# EAGLE design IoT_Pro_04 (EAGLE 7.3.0)
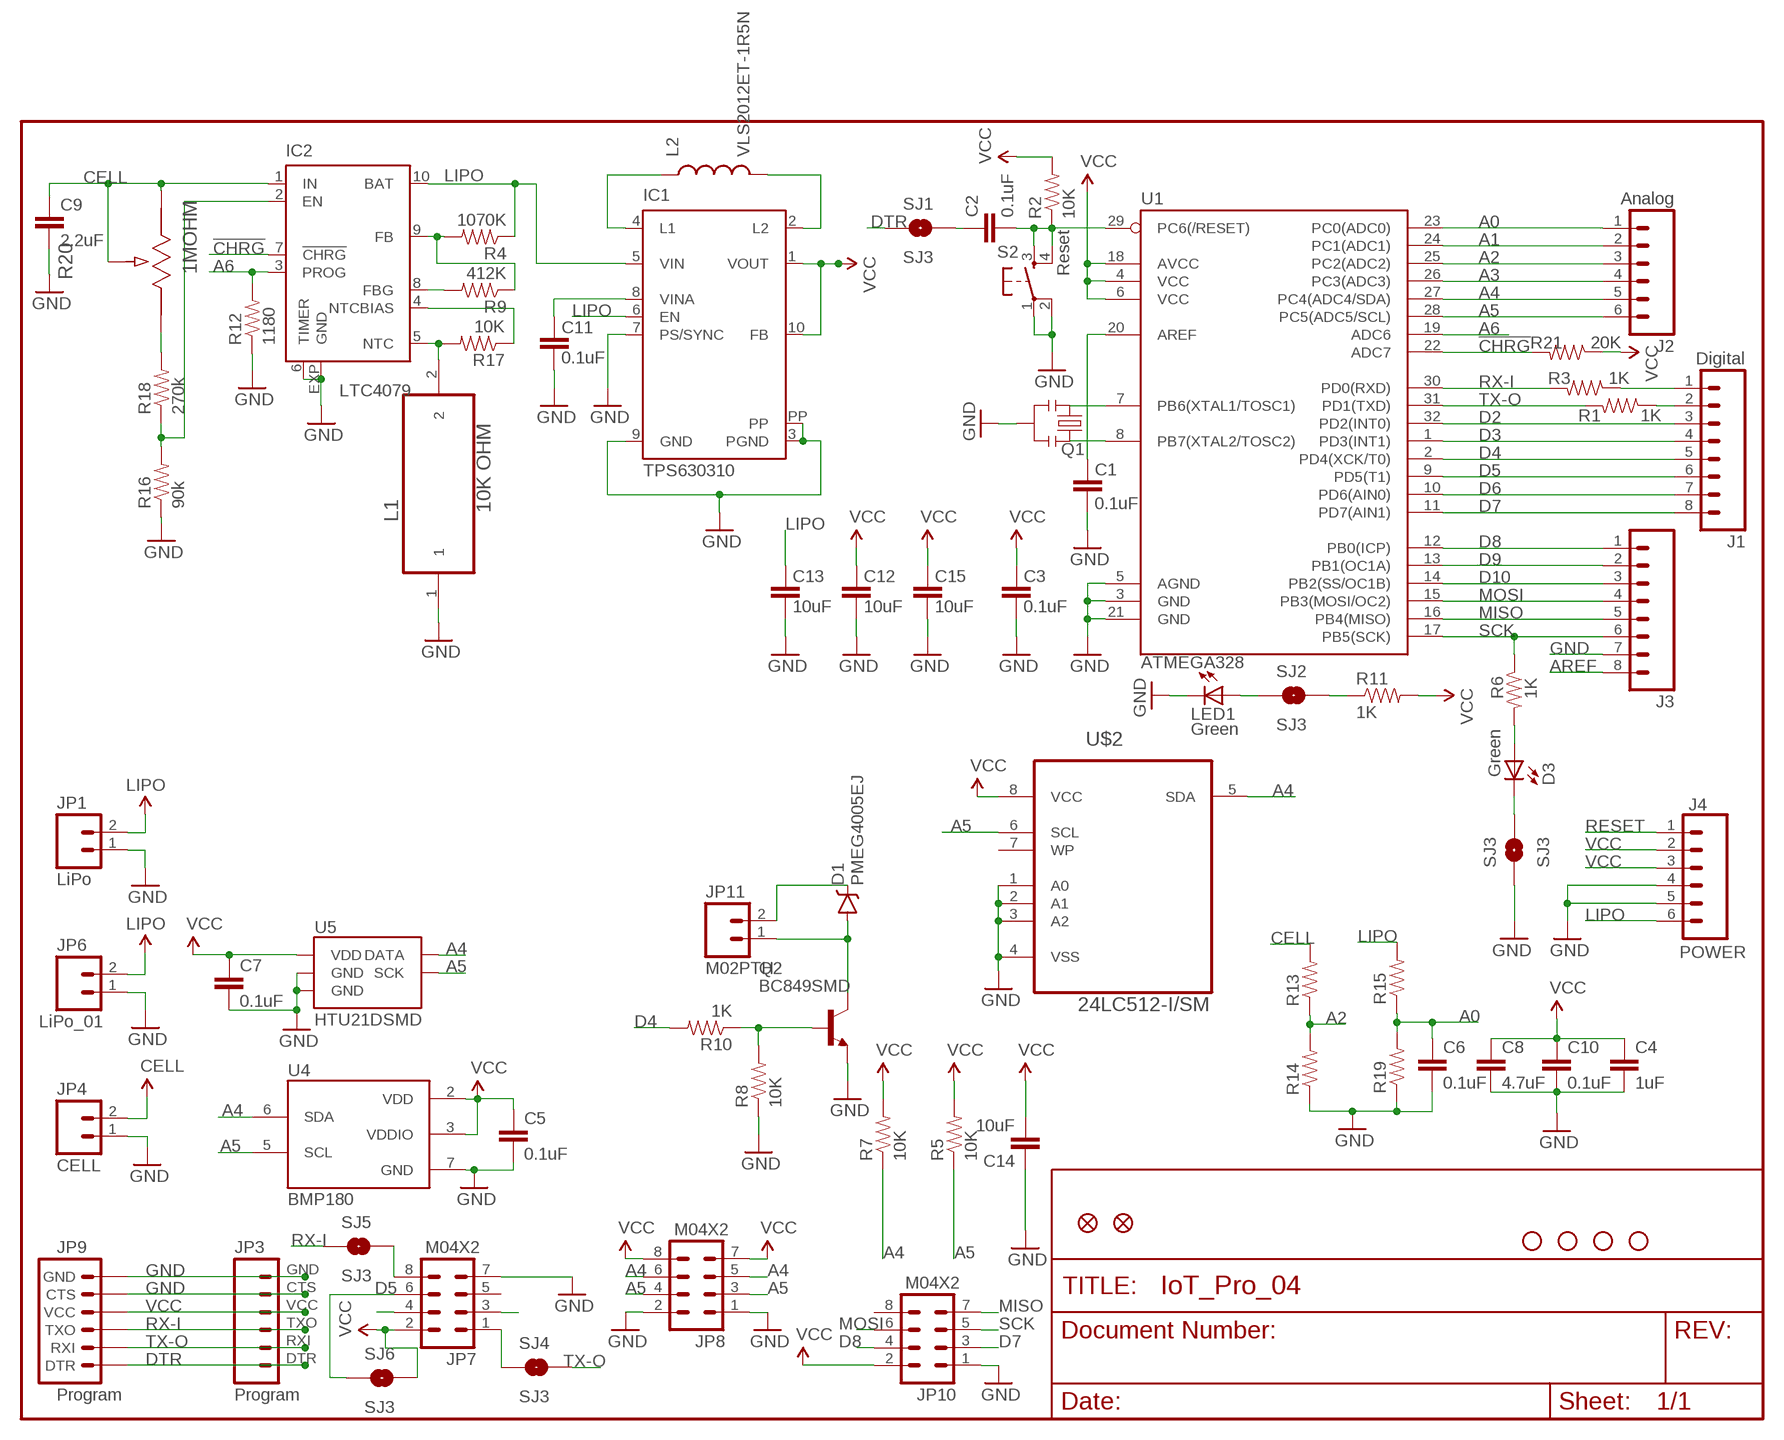
[diagram p0: schematic, sheet 1]

## Parts
C1  0.1uF  CAP0805  [0805]
C2  0.1uF  CAP0805  [0805]
C3  0.1uF  CAP0805  [0805]
C4  1uF  CAP0805  [0805]
C5  0.1uF  CAP0805  [0805]
C6  0.1uF  CAP0805  [0805]
C7  0.1uF  CAP0805  [0805]
C8  4.7uF  CAP0805  [0805]
C9  2.2uF  CAP0805  [0805]
C10  0.1uF  CAP0805  [0805]
C11  0.1uF  CAP0805  [0805]
C12  10uF  CAP0805  [0805]
C13  10uF  CAP0805  [0805]
C14  10uF  CAP0805  [0805]
C15  10uF  CAP0805  [0805]
D1  PMEG4005EJ  DIODE-SCHOTTKY-PMEG4005EJ  [SOD-323]
D3  Green  LG_T679-E1F1-1  [PLCC2]
IC1  TPS630310  [S-PDSO-N10]
IC2  LTC4079  [DFN10-3X3]
J1  Digital  M081X08  [1X08]
J2  Analog  M06SIP  [1X06]
J3  M081X08  [1X08]
J4  POWER  M06SIP  [1X06]
JP1  LiPo  M02POLAR  [MOLEX-1X2]
JP2  FIDUCIAL1X2.5  [FIDUCIAL-1X2.5]
JP3  Program  M06SIP  [1X06]
JP4  CELL  M02POLAR  [MOLEX-1X2]
JP5  FIDUCIAL1X2.5  [FIDUCIAL-1X2.5]
JP6  LiPo_01  M02PTH  [1X02]
JP7  M04X2  [2X4]
JP8  M04X2  [2X4]
JP9  Program  ARDUINO_SERIAL_PROGRAMSMD  [1X06-SMD]
JP10  M04X2  [2X4]
JP11  M02PTH  [1X02]
L1  10K OHM  B57421V2103J62  [THERM_B57421V2103J62]
L2  VLS2012ET-1R5N  INDUCTOR1007  [1007]
LED1  Green  LG_T679-E1F1-1  [PLCC2]
Q1  8MHZ  RESONATOR8MHZ  [RESONATOR-SMD]
Q2  BC849SMD  [SOT23-BEC]
R1  1K  RESISTOR0805-RES  [0805]
R2  10K  RESISTOR0805-RES  [0805]
R3  1K  RESISTOR0805-RES  [0805]
R4  1070K  RESISTOR0805-RES  [0805]
R5  10K  RESISTOR0805-RES  [0805]
R6  1K  RESISTOR0805-RES  [0805]
R7  10K  RESISTOR0805-RES  [0805]
R8  10K  RESISTOR0805-RES  [0805]
R9  412K  RESISTOR0805-RES  [0805]
R10  1K  RESISTOR0805-RES  [0805]
R11  1K  RESISTOR0805-RES  [0805]
R12  1180  RESISTOR0805-RES  [0805]
R13  RESISTOR0805-RES  [0805]
R14  RESISTOR0805-RES  [0805]
R15  RESISTOR0805-RES  [0805]
R16  90k  RESISTOR0805-RES  [0805]
R17  10K  RESISTOR0805-RES  [0805]
R18  270k  RESISTOR0805-RES  [0805]
R19  RESISTOR0805-RES  [0805]
R20  1MOHM  EVM2NSX80B16-2N  [POT_EVM2N]
R21  20K  RESISTOR0805-RES  [0805]
S2  Reset  TAC_SWITCHSMD  [TACTILE_SWITCH_SMD]
SJ1  SJ3  SOLDERJUMPERNC2  [SJ_2S-NOTRACE]
SJ2  SJ3  SOLDERJUMPERNC2  [SJ_2S-NOTRACE]
SJ3  SJ3  SOLDERJUMPERNC2  [SJ_2S-NOTRACE]
SJ4  SJ3  SOLDERJUMPERNC2  [SJ_2S-NOTRACE]
SJ5  SJ3  SOLDERJUMPERNC2  [SJ_2S-NOTRACE]
SJ6  SJ3  SOLDERJUMPERNC2  [SJ_2S-NOTRACE]
U1  ATMEGA328  ATMEGA168  [TQFP32-08]
U4  BMP180  [BMP180]
U5  HTU21DSMD  [HTU21D]
U$1  STAND-OFFTIGHT  [STAND-OFF-TIGHT]
U$2  24LC512-I/SM  [SOIC127P794X203-8N]
U$3  STAND-OFFTIGHT  [STAND-OFF-TIGHT]
U$9  STAND-OFFTIGHT  [STAND-OFF-TIGHT]
U$10  STAND-OFFTIGHT  [STAND-OFF-TIGHT]

## Nets
!CHRG: IC2.7(!CHRG) R21.2 U1.22(ADC7)
A0: C6.1 J2.1 R15.1 R19.2 U1.23(PC0(ADC0))
A1: J2.2 U1.24(PC1(ADC1))
A2: J2.3 R13.1 R14.2 U1.25(PC2(ADC2))
A3: J2.4 U1.26(PC3(ADC3))
A4: J2.5 JP8.5 JP8.6 R7.1 U1.27(PC4(ADC4/SDA)) U4.6(SDA) U5.DATA U$2.5(SDA)
A5: J2.6 JP8.3 JP8.4 R5.1 U1.28(PC5(ADC5/SCL)) U4.5(SCL) U5.SCK U$2.6(SCL)
A6: IC2.3(PROG) R12.2 U1.19(ADC6)
AREF: C1.2 J3.8 U1.20(AREF)
CELL: C9.1 IC2.1(IN) JP4.2 R13.2 R20.2 R20.3
D2: J1.3 U1.32(PD2(INT0))
D3: J1.4 U1.1(PD3(INT1))
D4: J1.5 R10.2 U1.2(PD4(XCK/T0))
D5: J1.6 JP7.6 SJ6.1 U1.9(PD5(T1))
D6: J1.7 U1.10(PD6(AIN0))
D7: J1.8 JP10.3 U1.11(PD7(AIN1))
D8: J3.1 JP10.4 U1.12(PB0(ICP))
D9: J3.2 U1.13(PB1(OC1A))
D10: J3.3 U1.14(PB2(SS/OC1B))
DTR: JP3.DTR JP9.1(DTR) SJ1.1
GND [vcc]: C1.1 C3.1 C4.2 C5.2 C6.2 C7.2 C8.2 C9.2 C10.2 C11.1 C12.1 C13.1 C14.1 C15.1 IC1.3(PGND) IC1.7(PS/SYNC) IC1.9(GND) IC1.PP IC2.6(TIMER) IC2.EXP(GND) J3.7 J4.4 J4.5 JP1.1 JP3.CTS JP3.GND JP4.1 JP6.1 JP7.7 JP8.1 JP8.2 JP9.5(CTS) JP9.6(GND) JP10.1 L1.1 LED1.C Q1.2 Q2.E R8.1 R12.1 R14.1 R16.1 R19.1 S2.1 S2.2 SJ3.1 U1.3(GND) U1.5(AGND) U1.21(GND) U4.7(GND) U5.7(GND) U5.GND U$2.1(A0) U$2.2(A1) U$2.3(A2) U$2.4(VSS)
LIPO: C13.2 IC1.5(VIN) IC1.6(EN) IC2.10(BAT) J4.6 JP1.2 JP6.2 R4.1 R15.2
MISO: J3.5 JP10.7 U1.16(PB4(MISO))
MOSI: J3.4 JP10.6 U1.15(PB3(MOSI/OC2))
N: IC2.2(EN) R16.2 R18.1
N$1: C2.1 SJ1.2
N$3: Q1.1 U1.8(PB7(XTAL2/TOSC2))
N$4: Q1.3 U1.7(PB6(XTAL1/TOSC1))
N$5: JP7.3
N$6: LED1.A SJ2.1
N$7: D3.A R6.2
N$8: R11.1 SJ2.2
N$9: D3.C SJ3.2
N$10: IC2.9(FB) R4.2 R9.1
N$11: JP7.4
N$12: D1.A JP11.1 Q2.C
N$13: D1.C JP11.2
N$14: Q2.B R8.2 R10.1
N$16: R18.2 R20.1
N$28: JP7.1 SJ4.1
N$29: JP7.8 SJ5.2
N$30: IC1.4(L1) L2.1
N$31: IC2.8(FBG) R9.2
N$32: IC2.4(NTCBIAS) R17.1
N$33: IC2.5(NTC) L1.2 R17.2
N$34: IC1.2(L2) L2.2
N$35: C11.2 IC1.8(VINA)
RESET: C2.2 J4.1 R2.1 S2.3 S2.4 U1.29(PC6(/RESET))
RX-I: JP3.TXO JP9.3(TXO) R3.2 SJ5.1 U1.30(PD0(RXD))
RX-IP: J1.2 R1.1
SCK: J3.6 JP10.5 R6.1 U1.17(PB5(SCK))
TX-O: JP3.RXI JP9.2(RXI) R1.2 SJ4.2 U1.31(PD1(TXD))
TX-OP: J1.1 R3.1
VCC: C3.2 C4.1 C5.1 C7.1 C8.1 C10.1 C12.2 C14.2 C15.2 IC1.1(VOUT) IC1.10(FB) J4.2 J4.3 JP3.VCC JP7.2 JP8.7 JP8.8 JP9.4(VCC) JP10.2 R2.2 R5.2 R7.2 R11.2 R21.1 SJ6.2 U1.4(VCC) U1.6(VCC) U1.18(AVCC) U4.2(VDD) U4.3(VDDIO) U5.VDD U$2.8(VCC)
Unconnected: JP7.5 JP10.8 U$2.7(WP)

## Library data of the parts
C1-C13 C15 = SparkFun:CAP: Capacitor Standard 0603 ceramic capacitor, and 0.1" leaded capacitor.
C14 = SparkFun-Passives:CAP: Capacitor Standard 0603 ceramic capacitor, and 0.1" leaded capacitor.
D1 = SparkFun-DiscreteSemi:DIODE-SCHOTTKY: Schottky diodes in SFE's production catalog BAT20J 1A 23V 0.62Vf RB751 120mA 40V 0.37Vf PMEG4005EJ 0.5A 40V 0.42Vf MBRA140 1A 40V 0.5Vf B340A 3A 40V SMA; PROD_ID: DIO-10955
D3 LED1 = led:*_T679-?-1: LC TOPLED® Low Current LED Source: http://catalog.osram-os.com .. LG_LS_LY_T679_OBS.pdf; COLOR: green
IC1 = mojaknižnica:TPS63031: LOW INPUT VOLTAGE SYNCHRONOUS BOOST CONVERTER WITH 1.3-A SWITCHES Source: http://focus.ti.com/lit/ds/symlink/tps61200.pdf; MPN: TPS61200DRCT; OC_FARNELL: 1471238; OC_NEWARK: 37M0066
IC2 = mojaknižnica:LTC4079: Standalone Linear Li-Ion Battery Charger with Micropower Comparator Source: http://www.linear.com .. 4062fa.pdf; MPN: LTC4062EDD#PBF; OC_FARNELL: 1648037; OC_NEWARK: 58M0900
J1 J3 = SparkFun:M08: Header 8 Standard 8-pin 0.1" header. Use with straight break away headers (SKU : PRT-00116), right angle break away headers (PRT-00553), swiss pins (PRT-00743), machine pins (PRT-00117), and female headers (PRT-00115).
J2 J4 = SparkFun:M06: Header 6 Standard 6-pin 0.1" header. Use with straight break away headers (SKU : PRT-00116), right angle break away headers (PRT-00553), swiss pins (PRT-00743), machine pins (PRT-00117), and female headers (PRT-00115). Molex polarized connector foot print use with SKU : PRT-08094 with associated ...
JP1 JP4 JP11 = SparkFun-Connectors:M02: Standard 2-pin 0.1" header. Use with - straight break away headers ( PRT-00116) - right angle break away headers (PRT-00553) - swiss pins (PRT-00743) - machine pins (PRT-00117) - female headers (PRT-00115) Molex polarized connector foot print use with: PRT-08233 with associated crimp pins and housings. 2.54_SCREWTERM for use with PRT-10571. 3.5mm Screw Terminal footprints for PRT-08084 5mm Screw Terminal footprints for use with PRT-08432
JP2 JP5 = abes:FIDUCIAL: Fiducial Alignment Points Various fiducial points for machine vision alignment.
JP3 = SparkFun-Connectors:M06: Header 6 Standard 6-pin 0.1" header. Use with straight break away headers (SKU : PRT-00116), right angle break away headers (PRT-00553), swiss pins (PRT-00743), machine pins (PRT-00117), and female headers (PRT-00115). Molex polarized connector foot print use with SKU : PRT-08094 with associated ...
JP6 = SparkFun:M02: Header 2 Standard 2-pin 0.1" header. Use with straight break away headers (SKU : PRT-00116), right angle break away headers (PRT-00553), swiss pins (PRT-00743), machine pins (PRT-00117), and female headers (PRT-00115). Molex polarized connector foot print use with SKU : PRT-08233 with associated crimp pins and housings.
JP7 JP8 JP10 = SparkFun-Connectors:M04X2: .1" header, two rows of four.
JP9 = SparkFun:ARDUINO_SERIAL_PROGRAM
L1 = NTC:B57421V2103J62: THERMISTOR NTC 10K OHM 5%; MPN: B57421V2103J62; OC_FARNELL: 1712519; OC_NEWARK: 43J3525; SUPPLIER: EPCOS Inc; TOLERANCE: ±5%
L2 = SparkFun-Passives:INDUCTOR: Inductors Basic Inductor/Choke - 0603 and 1206. Footprints are not proven and vary greatly between part numbers. INDUCTOR POWER 3.3UH 4.0A SMD 0.197" L x 0.197" W x 0.177" H (5.00mm x 5.00mm x 4.50mm)
Q1 = SparkFun-FreqCtrl:RESONATOR: Resonator Small SMD resonator. Used, eg, on the Arduino Pro/ Pro Mini boards. 8MHz- XTAL-08895 16MHz- XTAL-08900; PROD_ID: XTAL-08895
Q2 = transistor-npn:BC849*: NPN Transistor
R1-R12 R16-R18 R21 = SparkFun:RESISTOR: Resistor Basic schematic elements and footprints for 0603, 1206, and PTH resistors.
R13-R15 R19 = SparkFun-Passives:RESISTOR: Resistor Basic schematic elements and footprints for 0603, 1206, and PTH resistors.
R20 = Panasonic-Trimmer_Potentiometers:EVM: Potentiometers; MPN: EVM2NSX80B16; OC_FARNELL: 1849765; OC_NEWARK: 17T5158; PACKAGE: EVM2N; POWERRATING: 0.15W; SUPPLIER: PANASONIC; TOLERANCE: ±25 %
S2 = SparkFun:TAC_SWITCH: Momentary Switch Button commonly used for reset or general input. Spark Fun Electronics SKU : COM-00097
SJ1-SJ6 = SparkFun:SOLDERJUMPER: Solder Jumper Standard SMD solder jumper. Used to automate production. Two varients : Normally Open and Normally Closed are the same, but have different paste layers. NC will have a large amount of paste and should jumper during reflow.
U1 = SparkFun:ATMEGA168
U4 = SparkFun-Sensors:BMP180: BOSCH BMP180 DIGITAL BAROMETRIC PRESSURE SENSOR Web page: http://www.bosch-sensortec.com/en/homepage/products_3/environmental_sensors_1/bmp180_1/bmp180 Datasheet: http://ae-bst.resource.bosch.com/media/products/dokumente/bmp180/BST-BMP180-DS000-09.pdf The BMP180 is the function compatible successor of the BMP085, a new generation of high precision digital pressure sensors for consumer applications. The ultra-low power, low voltage electronics of the BMP180 is optimized for use in mobile phones, PDAs, GPS navigation devices and outdoor equipment. With a low altitude noise of merely 0.25m at fast conversion time, the BMP180 offers superior performance. The I2C interface allows for easy system integration with a microcontroller. The BMP180 is based on piezo-resistive technology for EMC robustness, high accuracy and linearity as well as long term stability. Key features: - Temperature measurement included - I2C interface - Fully calibrated - Pb-free, halogen-free and RoHS compliant, - MSL 1 Basic specs: Pressure range: 300 to 1100hPa (+9000m to -500m relating to sea level) Supply voltage: 1.8 to 3.6V (VDD), 1.62V to 3.6V (VDDIO) Package: LGA package with metal lid Small footprint: 3.6mm x 3.8mm Super-flat: 0.93mm height Low power: 5μA at 1 sample / sec. in standard mode Low noise: 0.06hPa (0.5m) in ultra low power mode, 0.02hPa (0.17m) advanced resolution mode Typical applications: - Enhancement of GPS navigation (dead-reckoning, slope detection, etc.) - In- and out-door navigation - Leisure and sports - Weather forecast - Vertical velocity indication (rise/sink speed)
U5 = SparkFun-Sensors:HTU21D
U$1 U$3 U$9 U$10 = SparkFun-Electromechanical:STAND-OFF: #4 Stand Off This is the mechanical footprint for a #4 phillips button head screw. Use the keepout ring to avoid running the screw head into surrounding components. SKU : PRT-00447
U$2 = 24LC512-I:24LC512-I/SM: 512K I2C Serial EEPROM; MPN: 24LC512-I/SM; OC_FARNELL: 9758038; OC_NEWARK: 62K0582; PACKAGE: SOIC-8; SUPPLIER: MICROCHIP

## Net classes
0 default: width 0.203 mm
1 vcc: width 0.254 mm

## Board
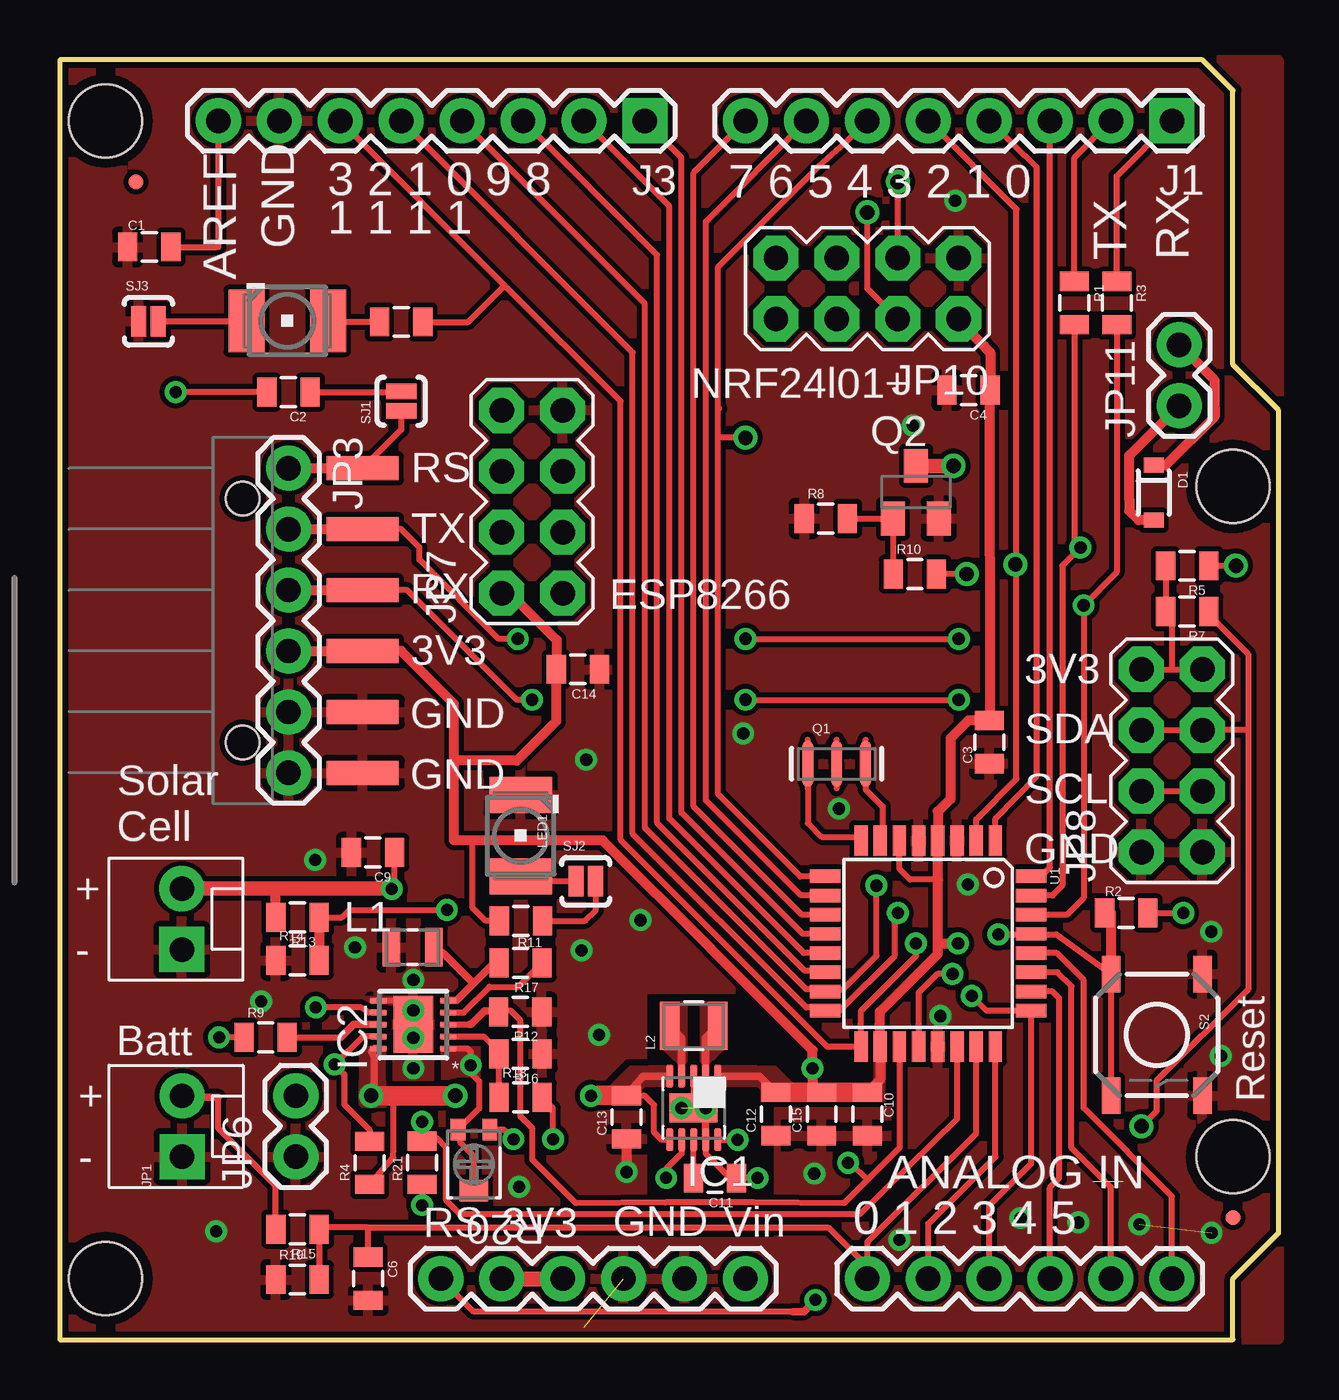
[diagram p1: board, top side]
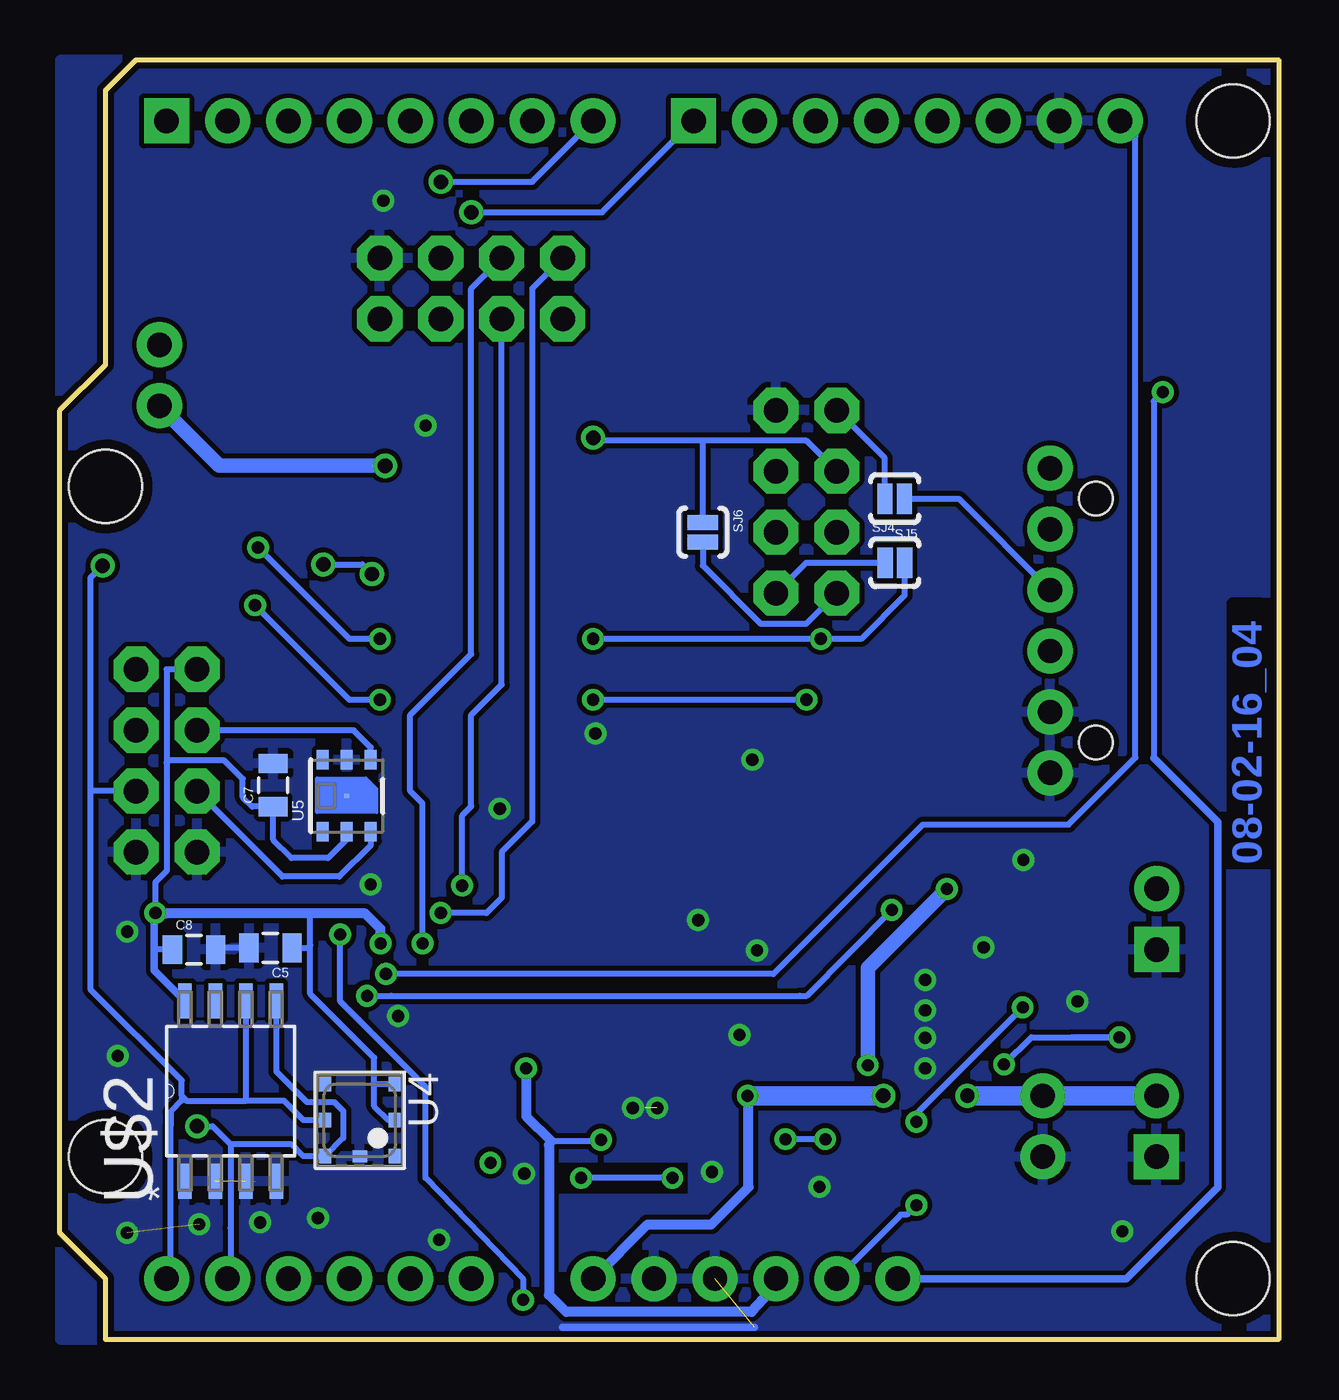
[diagram p2: board, bottom side, seen from below]

Size 50.8 x 53.34 mm. Coordinates in mm from the lower left corner, seen from the top.
Outline: 0,53.34 0,0 48.9,0 48.9,2.54 50.8,4.45 50.8,38.73 48.9,40.64 48.9,52.07 47.62,53.34 0,53.34
Copper layers (1*16): Top 0.035mm / dielectric 1.5mm / Bottom 0.035mm
Design rules "default *": minimum track width 10mil, minimum drill 24mil, track to track 8mil, track to pad 8mil, pad to pad 8mil, via to via 8mil, smd to smd 8mil, copper to edge 10mil, drill to drill 8mil, minimum pad ring 10mil, minimum via ring 8mil, stop-mask expansion 4mil, vias tented up to drill 20mil, thermal gap 10mil

### Footprints (pad centres in the part's own frame; a part is rotated, then mirrored left to right if it is on the bottom)
0805 = smd 0.8 x 1.2: 1 -0.9,0; 2 0.9,0
SOD-323 = smd 0.63 x 0.83: A 1.15,0; C -1.15,0
PLCC2 = smd 2.6 x 1.5: A 0,1.7; C 0,-1.7
S-PDSO-N10 = smd 0.28 x 0.95: 1 -1,-1.325; 2 -0.5,-1.325; 3 0,-1.325; 4 0.5,-1.325; 5 1,-1.325; 6 1,1.325; 7 0.5,1.325; 8 0,1.325; 9 -0.5,1.325; 10 -1,1.325 | smd 2 x 1.2: PP 0,0
DFN10-3X3 = smd 0.25 x 0.7: 1 -1,-1.45; 2 -0.5,-1.45; 3 0,-1.45; 4 0.5,-1.45; 5 1,-1.45; 6 1,1.45; 7 0.5,1.45; 8 0,1.45; 9 -0.5,1.45; 10 -1,1.45 | smd 2.38 x 1.65: EXP 0,0
1X08 = drill 1.016 pad 1.88 square: 1 0,0 | drill 1.016 pad 1.88: 2 2.54,0; 3 5.08,0; 4 7.62,0; 5 10.16,0; 6 12.7,0; 7 15.24,0; 8 17.78,0
1X06 = drill 1.016 pad 1.88: 1 0,0; 2 2.54,0; 3 5.08,0; 4 7.62,0; 5 10.16,0; 6 12.7,0
MOLEX-1X2 = drill 1.016 pad 1.88 square: 1 0,0 | drill 1.016 pad 1.88: 2 2.54,0
FIDUCIAL-1X2.5 = smd 0.635 x 0.635: 1 0,0
1X06' = drill 1.016 pad 1.88: CTS 10.16,0; DTR 0,0; GND 12.7,0; RXI 2.54,0; TXO 5.08,0; VCC 7.62,0
1X02 = drill 1.016 pad 1.88: 1 0,0; 2 2.54,0
2X4 = drill 1.016 pad 1.88 octagon: 1 -3.81,-1.27; 2 -3.81,1.27; 3 -1.27,-1.27; 4 -1.27,1.27; 5 1.27,-1.27; 6 1.27,1.27; 7 3.81,-1.27; 8 3.81,1.27
1X06-SMD = smd 1 x 3: 1 -6.35,5; 2 -3.81,5; 3 -1.27,5; 4 1.27,5; 5 3.81,5; 6 6.35,5 | hole 1.4: -5.08,0; 5.08,0
THERM_B57421V2103J62 = smd 0.737 x 1.6: 1 -0.889,0; 2 0.889,0
1007 = smd 2 x 0.8: 1 0,1; 2 0,-1
RESONATOR-SMD = smd 0.45 x 1.905: 1 -1.2,0; 2 0,0; 3 1.2,0
SOT23-BEC = smd 1 x 1.4: B -0.95,-1.1; C 0,1.1; E 0.95,-1.1
POT_EVM2N = smd 0.61 x 0.889: 1 -0.66,-1.448; 3 0.66,-1.448 | smd 1.194 x 0.889: 2 0,1.092
TACTILE_SWITCH_SMD = smd 1.524 x 0.762: 1 -2.54,1.905; 2 2.54,1.905; 3 -2.54,-1.905; 4 2.54,-1.905
SJ_2S-NOTRACE = smd 0.635 x 1.27: 1 -0.401,0; 2 0.413,0
TQFP32-08 = smd 1.27 x 0.559: 1 -4.293,2.8; 2 -4.293,2; 3 -4.293,1.2; 4 -4.293,0.4; 5 -4.293,-0.4; 6 -4.293,-1.2; 7 -4.293,-2; 8 -4.293,-2.8; 17 4.293,-2.8; 18 4.293,-2; 19 4.293,-1.2; 20 4.293,-0.4; 21 4.293,0.4; 22 4.293,1.2; 23 4.293,2; 24 4.293,2.8 | smd 0.559 x 1.27: 9 -2.8,-4.293; 10 -2,-4.293; 11 -1.2,-4.293; 12 -0.4,-4.293; 13 0.4,-4.293; 14 1.2,-4.293; 15 2,-4.293; 16 2.8,-4.293; 25 2.8,4.293; 26 2,4.293; 27 1.2,4.293; 28 0.4,4.293; 29 -0.4,4.293; 30 -1.2,4.293; 31 -2,4.293; 32 -2.8,4.293
BMP180 = smd 0.6 x 0.5: 1 1.5,1.45; 2 0,1.45; 3 -1.5,1.45; 4 -1.5,-1.45; 5 0,-1.45; 6 1.5,-1.45 | smd 0.5 x 0.6: 7 1.5,0
HTU21D = smd 0.2 x 0.2: 7 0,0 | smd 0.8 x 0.5: DATA 1.5,-1; GND 1.5,0; NC@1 -1.5,1; NC@6 1.5,1; SCK -1.5,-1; VDD -1.5,0
STAND-OFF-TIGHT = hole 3.048: 0,0
SOIC127P794X203-8N = smd 1.473 x 0.559: 1 -3.759,1.905; 2 -3.759,0.635; 3 -3.759,-0.635; 4 -3.759,-1.905; 5 3.759,-1.905; 6 3.759,-0.635; 7 3.759,0.635; 8 3.759,1.905

### Placement (x,y rotation side)
C1  3.73,45.54 0 top
C2  9.53,39.5 180 top
C3  38.75,24.91 90 top
C4  37.87,39.57 180 top
C5  42.02,16.32 180 bottom
C6  12.84,2.53 270 top
C7  41.91,23.11 90 bottom
C8  45.21,16.26 0 bottom
C9  13.05,20.3 180 top
C10  33.66,9.4 270 top
C11  27.3,6.73 180 top
C12  29.84,9.4 90 top
C13  23.62,9.27 90 top
C14  21.59,27.94 180 top
C15  31.75,9.4 90 top
D1  45.59,35.31 270 top
D3  9.48,42.46 270 top
IC1  26.42,9.65 180 top
IC2  14.73,13.13 90 top
J1  46.35,50.8 180 top
J2  33.66,2.54 0 top
J3  24.38,50.8 180 top
J4  15.88,2.54 0 top
JP1  5.09,7.62 90 top
JP2  48.9,5.08 0 top
JP3  Program  [1X06']  9.53,36.32 270 top
JP4  5.08,16.26 90 top
JP5  3.17,48.26 0 top
JP6  9.83,7.62 90 top
JP7  19.68,34.92 90 top
JP8  46.35,24.13 90 top
JP9  7.62,29.97 270 top
JP10  33.66,43.81 180 top
JP11  46.65,38.93 90 top
L1  14.7,16.35 0 top
L2  26.42,13.08 90 top
LED1  19.21,21 180 top
Q1  32.38,24 0 top
Q2  35.68,35.32 0 top
R1  42.29,43.21 270 top
R2  44.45,17.78 0 top
R3  44.05,43.21 270 top
R4  12.9,7.37 90 top
R5  46.99,32.26 180 top
R6  14.22,42.42 180 top
R7  46.99,30.35 180 top
R8  31.93,34.23 0 top
R9  8.58,12.6 0 top
R10  35.64,31.91 0 top
R11  19.21,17.45 180 top
R12  19.18,13.66 180 top
R13  9.9,17.6 180 top
R14  9.9,15.8 0 top
R15  9.9,4.6 180 top
R16  19.2,11.91 180 top
R17  19.2,15.7 180 top
R18  19.2,10.09 0 top
R19  9.9,2.5 0 top
R20  17.26,7.31 180 top
R21  15.1,7.37 90 top
S2  45.72,12.7 270 top
SJ1  14.22,39.12 90 top
SJ2  21.91,19.1 0 top
SJ3  3.69,42.45 0 top
SJ4  16,32.38 0 bottom
SJ5  16,35.05 180 bottom
SJ6  24,33.66 270 bottom
U1  36.2,16.51 270 top
U4  38.3,9.14 270 bottom
U5  38.85,22.67 90 bottom
U$1  1.91,50.8 0 top
U$2  43.69,10.36 90 bottom
U$3  1.91,2.54 0 top
U$9  48.9,35.56 0 top
U$10  48.9,7.62 0 top

### Tracks (layer width: path | path; a pad name or v marks a point on that pad's centre or on a via)
!CHRG  (via drill 0.5)
  Top 0.254: U1.22 37.4,9.2 33.34,5.22 17.1,5.22 16.68,5.22 16.1,5.8 16.1,8 15.7,8.4 R21.2 v15.1,9.07 | IC2.7 12.87,13.63 12.53,13.85 v10.67,13.85 v10.67,13.84
  Bottom 0.254: v15.1,9.07 15.1,9.41 v10.67,13.84
A0
  Top 0.254: U1.23 38.2,8.6 33.66,4.06 | J2.1 33.66,3.05 | 33.66,3.05 33.66,4.06 | 33.66,4.02 33.66,4.06 | 33.66,3.05 32.03,4.67 12.83,4.67 | 12.83,4.67 10.87,4.67 R15.1 R19.2 | C6.1 12.84,4.66 12.83,4.67
A1
  Top 0.254: U1.24 38.99,7.63 36.2,4.83 J2.2
A2  (via drill 0.5)
  Top 0.254: J2.3 38.86,2.67 38.73,2.79 38.73,5.59 40.49,7.34 U1.25 38.62,13.71 v38.01,14.33 | R13.1 11.76,17.6 12.06,17.91 v16.13,17.91
  Top 0.406: R13.1 R14.2
  Bottom 0.254: v38.01,14.33 36.98,14.33 19.96,14.33 19.67,14.33 v16.13,17.91
A3
  Top 0.254: U1.26 41.37,14.51 41.66,14.22 41.66,6.73 41.27,6.35 J2.4
A4  (via drill 0.6)
  Top 0.254: U1.27 41.59,15.31 42.16,14.73 42.16,8 43.81,6.35 J2.5 | R7.1 47.64,30.46 49.53,28.57 49.53,25.4 | 49.53,25.4 JP8.5 JP8.6 | 49.53,25.4 49.53,14.61 45.72,10.79 45.72,9.53 v45.09,8.89
  Bottom 0.254: 43.69,8.14 43.68,4.64 43.68,2.67 J2.5 | U5.DATA 37.85,24.69 38.56,25.39 JP8.6 | v45.09,8.89 44.44,8.89 43.69,8.14 | 43.69,8.14 43.68,8.13 41.15,8.13 40.66,7.64 U4.6 38.99,8.4 38.99,9.53 39.37,9.91 40.51,9.91 41.78,11.18 41.78,14.1 U$2.5
A5  (via drill 0.6)
  Top 0.254: U1.28 41.55,16.11 42.67,14.99 42.67,9.65 46.35,5.97 J2.6 | JP8.4 JP8.3 | R5.1 v49.02,32.26
  Bottom 0.254: JP8.3 49.53,22.86 | 49.53,22.86 49.53,14.61 45.72,10.79 45.72,10.16 | 49.53,22.86 49.53,31.75 v49.02,32.26 | 45.72,10.16 45.49,9.93 43.08,9.93 43.05,9.96 | U5.SCK 37.85,20.6 39.15,19.3 41.52,19.3 JP8.4 | 45.72,10.16 45.72,9.96 46.19,9.49 46.19,8.9 46.2,8.9 46.2,4.69 46.2,2.69 J2.6 | U$2.6 43.05,9.96 | U4.5 40.64,9.14 41.46,9.96 43.05,9.96
A6  (via drill 0.5)
  Top 0.254: U1.19 34.99,8 33.65,6.65 | IC2.3 17.08,13.13 | 33.65,6.65 32.69,5.68 arc1 21.52,5.68 19.7,7.5 19.7,8.8 19.2,9.3 19.2,13.3 18.8,13.7 18.32,13.7 R12.2 | v32.86,7.37 32.93,7.37 33.65,6.65
  Top 0.305: 17.08,13.13 17.13,13.13 17.7,13.7 18.24,13.7 R12.2
AREF  (via drill 0.51)
  Top 0.254: U1.20 35.8,14.46 36.58,15.24 v37.21,15.24 | J3.8 6.6,45.55 6.53,45.54 C1.2
  Bottom 0.254: v37.21,15.24 21.06,15.24 14.84,21.46 8.76,21.46 5.97,24.26 5.97,50.16 J3.8 6.73,50.93
CELL  (via drill 0.5, 0.5 pad 0.41)
  Top 0.254: IC2.1 17,12.13 17.13,12 v17.13,11.44 17.13,11.11 17.47,10.76 17.47,9.63 R20.3 16.7,8.75 16.7,8.2 17.26,7.64 R20.2 | 13.95,18.9 C9.1
  Top 0.305: 13.95,18.9 v13.83,18.78
  Top 0.406: 13.71,18.8 v13.83,18.78 | R13.2 9,18.8
  Top 0.61: JP4.2 9,18.8 13.71,18.8
  Bottom 0.61: v17.13,11.44 17.13,11.98 17.12,13.68 17.12,15.49 v13.83,18.78
  pour Top (isolate 0.254, no thermals): 15.88,12.06 15.88,10.92 17.53,10.92 17.53,12.32 15.88,12.32
D2
  Top 0.254: U1.32 40.89,19.31 40.89,19.3 41.27,19.68 J1.3
D3
  Top 0.254: U1.1 38.99,21.72 40.72,23.5 40.72,48.88 J1.4
D4  (via drill 0.6)
  Top 0.254: U1.2 38.2,21.68 39.88,23.37 39.88,32.26 | 39.88,32.26 39.88,47.12 J1.5 | 39.88,32.26 v39.83,32.31 | v37.8,31.91 R10.2
  Bottom 0.254: v39.83,32.31 38.2,32.31 38.14,32.25 v37.8,31.91
D5  (via drill 0.6)
  Top 0.254: U1.9 32,19.3 | U1.9 | U1.9 30.86,19.3 27.43,22.73 27.43,37.59 | 27.43,37.59 27.43,38.86 | 27.43,38.86 27.43,44.7 31.62,48.9 32.77,49.91 J1.6 | 27.43,38.86 27.48,38.81 | v28.57,37.59 27.43,37.59
  Bottom 0.254: JP7.6 19.68,37.47 24,37.47 | 24,37.47 28.45,37.47 v28.57,37.59 | SJ6.1 24,37.47
D6
  Top 0.254: U1.10 31.78,18.51 31.75,18.54 30.86,18.54 26.92,22.48 26.92,46.61 J1.7
D7  (via drill 0.6)
  Top 0.254: U1.11 30.93,17.71 26.42,22.23 26.42,48.64 J1.8 | JP10.3 v34.92,48.26
  Bottom 0.254: J1.8 31.11,48.26 v34.92,48.26
D8  (via drill 0.6)
  Top 0.254: U1.12 30.97,16.91 25.91,21.97 25.91,49.28 J3.1 | v33.66,46.99 33.66,43.81 JP10.4
  Bottom 0.254: v33.66,46.99 28.19,46.99 J3.1
D9
  Top 0.254: U1.13 31.01,16.11 25.4,21.72 25.4,47.24 J3.2
D10
  Top 0.254: J3.3 24.89,45.21 24.89,21.53 31.05,15.37 31.88,15.37 31.88,15.34 U1.14
DTR
  Top 0.254: 10.79,36.45 10.71,36.37 JP9.1 14.22,37.93 SJ1.1
  Top 0.406: JP3.DTR JP9.1
GND  (via drill 0.5, 0.51)  (4 unrouted)
  Top 0.254: IC2.6 14.36,14.13 v14.73,13.72 | IC1.3 IC1.PP | 25.92,9.64 v25.9,9.65 | IC1.7 25.92,7.75 25.27,7.11 v25.27,6.73 | 28.83,6.73 v29.08,6.73 C11.1 27.94,6.73 26.92,7.75 IC1.9
  Top 0.305: IC1.PP 26.92,9.15 IC1.9
  Top 0.406: C13.1 23.62,7.37 v23.62,6.98
  Bottom 0: U$2.3 42.68,6.6 42.67,6.6
  Bottom 0.254: C5.2 44.25,16.32 C8.2 | v25.27,6.73 v29.08,6.73
  Bottom 0.305: 21.84,0.51 29.84,0.51
  other vias: 32.47,22.13 21.94,24.17 47.99,17 35.56,38.1 48.01,4.45 37.85,18.97 19.13,6.36 28.48,25.26 34.99,4.15 31.45,6.92 37.32,47.48 48.4,11.83 10.64,19.99 12.3,16.34 40.05,5.06 42.45,4.88 45,4.81 36.7,13.48 21.74,16.22 6.51,4.51 14.73,12.57 24.2,17.48 8.38,14.1 26.92,9.65 22.48,12.7 14.73,11.3 14.73,14.99
  pour Top: 0,53.34 50.8,53.34 50.8,0 29.97,0 29.97,14.61 24.26,14.61 24.26,4.06 29.84,4.06 29.84,0 0,0
  pour Bottom: 0,53.34 50.8,53.34 50.8,0 0,0
LIPO  (via drill 0.5, 0.6)
  Top 0.254: R4.1 13.89,7.59 13.9,8 13.9,10.16 | R15.2 9,6.4 6.6,8.8 6.6,10.09 | IC1.6 25.07,8.33 24.77,8.64 24.77,9.78 24.37,10.17 C13.2
  Top 0.305: IC2.10 13.13,12.13 13,12 13.1,11.8 13.1,10.23 v12.97,10.16 | 6.6,10.09 5.16,10.09 JP1.2 | IC1.5 24.3,10.98 C13.2
  Top 0.406: v22.14,10.17 v22.13,10.16
  Top 0.813: v16.48,10.16 13.9,10.16 v12.97,10.16 | C13.2 v22.14,10.17
  Bottom 0.254: v12.97,10.16 13,10.16
  Bottom 0.406: J4.6 26.3,4.8 23.65,4.8 22.1,6.35 22.1,10.13 v22.13,10.16
  Bottom 0.813: v22.13,10.16 v16.48,10.16 | JP1.2 JP6.2 13,10.16
  pour Top (no thermals): 25.4,11.43 23.75,11.43 22.86,10.54 22.86,9.78 24.26,9.78 24.26,10.41 24.38,10.54 25.4,10.54
  pour Top (isolate 0.254, no thermals): 13.59,12.32 12.45,12.19 12.45,9.65 13.59,9.65
MISO  (via drill 0.51)
  Top 0.254: J3.5 23.88,41.15 23.88,21.08 31.11,13.84 32,13.84 31.9,13.74 U1.16 | U1.16 | U1.16 32,13.71 32,13.72 32.51,13.72 34.8,16 34.8,17.65 v34.92,17.78
  Bottom 0.254: JP10.7 31.11,43.81 31.11,21.59 32.38,20.32 32.38,18.41 33.02,17.78 v34.92,17.78
MOSI  (via drill 0.51)
  Top 0.254: J3.4 24.38,43.18 24.38,21.34 31.11,14.61 31.88,14.61 31.9,14.58 U1.15 | 32,14.48 31.93,14.48 U1.15 | v34.04,18.92 34.04,16 32.64,14.61 32.13,14.61 32,14.48 | 32,14.48 31.97,14.51 U1.15
  Bottom 0.254: v34.04,18.92 34.04,21.84 33.66,22.23 33.66,26.04 32.38,27.3 JP10.6
N
  Top 0.254: IC2.2 17.67,12.63 18.5,11.8 18.29,11.8 | 18.29,11.8 R16.2 | 18.29,11.8 18.29,10.2 R18.1
N$1
  Top 0.254: C2.1 14.19,39.5 SJ1.2
N$3
  Top 0.254: U1.8 33.24,20.95 31.75,20.95 31.18,21.53 Q1.1
N$4
  Top 0.254: U1.7 34.29,20.9 34.29,22.23 33.58,22.94 Q1.3
N$6
  Top 0.254: SJ2.1 19.54,19.1 LED1.A
N$7
  Top 0.254: R6.2 13.32,42.39 13.3,42.41 12.95,42.41 arc2 11.31,42.4 11.24,42.4 D3.A
N$8
  Top 0.254: SJ2.2 22.34,17.89 21.89,17.45 R11.1
N$9
  Top 0.254: SJ3.2 8.01,42.45 D3.C
N$10  (via drill 0.5)
  Top 0.254: IC2.9 12.63,12.63 v11.45,11.47 11.7,11.2 11.85,11.05 11.85,9.8 12.9,8.75 12.9,8.4 R4.2 | R9.1 7.9,12.6 v6.63,12.6
  Bottom 0.254: 8.5,12.6 v6.63,12.6 7.9,12.6 8.6,12.6 10.3,12.6 v11.45,11.47
N$12  (via drill 0.6)
  Top 0.254: Q2.C 35.72,36.42
  Top 0.406: JP11.1 44.58,36.85 44.58,35.05 44.58,34.54 44.97,34.16 D1.A
  Top 0.61: 35.72,36.42 v37.24,36.42
  Bottom 0.254: v37.24,36.42 37.24,36.43 | 43.31,36.43
  Bottom 0.61: 37.24,36.43 43.31,36.43 | 43.31,36.43 44.16,36.43 JP11.1
N$13
  Top 0.406: JP11.2 48.13,39.99 48.13,38.86 48.13,38.48 46.11,36.46 D1.C
N$14
  Top 0.254: R8.2 Q2.B R10.1
N$15  (via drill 0.6)
  other vias: 37.25,36.43
N$16  (via drill 0.5)
  Top 0.254: v20.55,8.35 20.55,9.64 R18.2 | R20.1 18.5,8.75 v18.9,8.35
  Bottom 0.254: v18.9,8.35 v20.55,8.35
N$17
  pour Bottom: 34.8,51.31 35.05,51.31 35.05,50.29 34.8,50.29
N$18
  pour Top: 34.8,51.31 35.05,51.31 35.05,50.29 34.8,50.29
N$19
  cutout Bottom: 24.64,7.37 29.72,7.37 29.72,6.1 24.64,6.1
N$20
  pour Bottom: 43.81,15.37 44.83,15.37 44.83,15.11 43.81,15.11
N$21
  pour Bottom: 44.96,3.05 45.21,3.05 45.21,2.03 44.96,2.03
N$22
  pour Bottom: 42.42,3.05 42.67,3.05 42.67,2.03 42.42,2.03
N$23
  pour Top: 42.42,3.05 42.67,3.05 42.67,2.03 42.42,2.03
N$24
  pour Top: 44.96,3.05 45.21,3.05 45.21,2.03 44.96,2.03
N$25
  pour Bottom: 43.69,15.24 43.69,14.99
N$26
  pour Bottom: 19.81,3.05 19.56,3.05 19.56,2.03 19.81,2.03
N$27
  cutout Top (isolate 0.254): 12.45,11.81 12.19,11.81 12.19,10.79 12.45,10.79
N$28
  Bottom 0.254: JP7.1 19.68,32.38 SJ4.1
N$29
  Bottom 0.254: SJ5.2 16.41,36.73 JP7.8
N$30
  Top 0.305: IC1.4 25.92,12.58 L2.1
  pour Top (no thermals): 25.78,11.43 25.15,12.06 25.02,12.06 25.02,14.1 26.04,14.1 26.16,14.1 26.16,11.56 26.04,11.43
N$31
  Top 0.254: R9.2 11.7,12.6
  Top 0.305: IC2.8 12.23,13.13 11.7,12.6
N$32
  Top 0.254: IC2.4 16.83,13.63 17.9,14.7 19.1,14.7 R17.1
N$33
  Top 0.305: IC2.5 16.53,14.13 17.25,14.85 | 17.25,14.85 17.8,15.4 18.1,15.7 R17.2 | L1.2 16,16.1 17.25,14.85
N$34
  Top 0.305: IC1.2 26.92,12.58 L2.2
  pour Top (no thermals): 27.05,11.43 27.69,12.06 27.81,12.06 27.81,14.1 26.8,14.1 26.67,14.1 26.67,11.56 26.8,11.43
N$35
  Top 0.254: C11.2 26.41,8.32 IC1.8
N$36
  cutout Top: 29.08,13.46 29.08,11.43 29.84,11.43 30.35,10.92 30.61,10.92 30.86,11.94 29.46,13.46
N$37
  cutout Top: 31.88,11.94 32.77,11.94 32.89,11.81 32.89,11.56 33.02,11.43 33.78,11.43 33.78,10.92 31.88,10.92
N$38
  cutout Top: 23.11,10.79 23.75,11.43 24.51,11.43 24.51,11.68 23.62,11.68 22.73,10.79
N$39
  cutout Top (isolate 0.254): 13.59,11.81 13.84,11.81 13.84,10.79 13.59,10.79
N$40
  cutout Top (isolate 0.254): 15.88,11.81 15.88,10.79 15.62,10.79 15.62,11.81
RESET  (via drill 0.5 pad 0.41, 0.51)
  Top 0.254: J4.1 17.25,1.16 30.56,1.16 | v39.12,16.89 40.39,16.89 40.41,16.91 U1.29 40.62,16.91 40.64,16.89 41.53,16.89 S2.3 S2.4 | C2.2 v4.83,39.5
  Top 0.305: 30.56,1.16 31.01,1.16 v31.5,1.65
  Top 0.406: R2.1 43.81,17.78 S2.3
  Bottom 0.254: v39.12,16.89 39.11,14.09 38.35,13.33 38.35,13.34 35.56,10.54 35.56,6.73 31.5,2.54 v31.5,1.65 | v4.83,39.5 5.21,39.12 5.21,24.24
  Bottom 0.305: J4.1 6.35,2.54 2.54,6.35 2.54,21.57 5.21,24.24
RX-I  (via drill 0.51)
  Top 0.254: U1.30 41.97,17.71 42.67,18.41 v42.67,30.61 44.05,31.99 R3.2 | v28.57,26.67 v37.47,26.67 | v19.68,26.67 19.05,26.67 14.48,31.24 JP9.3
  Top 0.406: JP3.TXO JP9.3
  Bottom 0.254: v42.67,30.61 38.73,26.67 v37.47,26.67 | v19.68,26.67 v28.57,26.67 | SJ5.1 13.34,35.05 JP3.TXO
RX-IP
  Top 0.254: R1.1 42.29,49.27 J1.2
SCK  (via drill 0.51)
  Top 0.254: 18.54,43.94 23.37,39.12 23.37,20.83 31.98,12.22 U1.17 33.4,13.71 35.69,16 v35.69,16.51 | 18.54,43.94 J3.6 | R6.1 17.02,42.42 18.54,43.94
  Bottom 0.254: JP10.5 33.66,43.81 33.66,28.57 36.2,26.04 36.2,22.86 35.69,22.35 v35.69,16.51
TX-O  (via drill 0.51)
  Top 0.254: U1.31 41.37,18.51 41.78,18.92 41.78,32.26 v42.55,33.02 42.29,33.28 R1.2 | v28.57,29.21 v37.47,29.21 | v19.09,29.21 18.29,29.21 14.99,32.51 14.99,33.02 14.22,33.78 JP9.2
  Top 0.406: JP3.RXI JP9.2
  Bottom 0.254: v42.55,33.02 38.73,29.21 v37.47,29.21 | v28.57,29.21 v19.09,29.21 17.4,29.21 15.59,31.02 SJ4.2
TX-OP
  Top 0.254: R3.1 44.05,48.5 J1.1
VCC  (via drill 0.5, 0.51)
  Top 0.254: U1.18 34.19,12.22 | 36.6,20.9 U1.4 | U1.6 34.99,19.61 35.43,19.18 36.6,19.18 | R2.2 v46.82,17.78 | JP8.8 46.35,27.94 | 46.35,27.94 JP8.7 | R5.2 R7.2 46.35,30.48 46.35,27.94 | 20.95,27.95 C14.2 | 20.69,25.77 20.68,25.77 | 16.43,24.13 17.09,24.11 16.42,24.14 | 16.42,20.81 17.47,20.85 | 27.15,16.28 27.15,16.27 | J4.2 18.26,2.54 | R11.2 17.75,17.45 17.2,18 17.2,20.81 | IC1.10 v28.25,8.33 | R21.1 v15.1,5.6
  Top 0.305: IC1.1 29.17,10.98 C12.2
  Top 0.406: 34.19,12.22 34.18,13.66 36.59,16.07 36.6,16.51 | 36.6,16.51 36.6,19.18 U1.4 | 36.6,16.51 v37.44,16.51 | JP3.VCC JP9.4 14.22,28.7 16.43,26.5 16.43,24.13 19.05,24.13 20.68,25.77 | 20.69,25.77 C14.2 20.7,27.95 20.7,29.16 19.05,30.82 JP7.2 | JP10.2 37.47,42.52 38.78,41.15 38.78,40.33 C4.1 38.73,39.37 38.76,25.91 C3.2 37.87,25.8 37.13,25.06 37.13,22.52 36.6,22.02 36.6,20.83 U1.4 | U1.18 34.2,10.84 C10.1 | 27.15,16.28 22.63,20.81 17.2,20.81 16.42,20.81 16.42,24.14 | 27.15,16.27 31.37,12.05 v31.37,11.3 31.37,10.43 31.24,10.3
  Top 0.635: J4.2 J4.3
  Top 0.813: C12.2 31.24,10.3 C15.2 C10.1
  Bottom 0.254: 46.38,17.75 v46.82,17.78 46.82,19.06 46.36,19.53 46.36,24.04 | JP8.8 46.35,27.94 46.36,24.04 | 46.36,24.04 46.25,24.15 43.96,24.15 43.18,23.37 43.18,22.61 42.79,22.21 C7.1 41.91,20.83 41.15,20.07 39.62,20.07 38.85,20.84 U5.VDD | U4.2 37.11,9.14 37.7,9.73 37.7,10.67 | 37.7,10.67 37.7,11.75 40.37,14.42 40.37,16.44 | 40.37,16.44 40.37,17.7 40.42,17.75 | C5.1 40.48,16.32 40.37,16.44 | C8.1 46.86,16.26 | U4.3 37.67,10.64 37.7,10.67 | SJ6.2 24,32.26 21.59,29.84 19.68,29.84 JP7.2 | v28.25,8.33 28.45,8.26 30.31,8.26 30.41,8.1 | v15.1,5.6 15.49,5.21 15.75,5.21 J4.2
  Bottom 0.305: v46.82,17.78 46.86,17.74 46.86,16.26 46.86,15.39 U$2.8
  Bottom 0.406: v37.44,16.51 37.44,17.12 38.08,17.75 40.42,17.75 46.38,17.75 | J4.3 20.95,2.27 21.97,1.15 29.7,1.15 30.41,1.86 30.41,8.1 | v31.37,11.3 31.37,9.31 30.31,8.26
  pour Top (no thermals): 27.43,11.43 29.84,11.43 30.61,10.67 30.61,9.91 29.21,9.91 29.21,10.41 29.08,10.54 27.43,10.54
  pour Top (no thermals): 33.91,11.68 33.91,10.79 33.91,10.16 34.16,9.91 34.42,9.91 34.42,11.68

### Text on the board
Bottom: 08-02-16_04
tPlace: 3 2 1 0 9 8 | 7 6 5 4 3 2 1 0 | 1 1 1 1 | GND | TX | RX | AREF | NRF24l01+ | RS | TX | RX | ESP8266 | 3V3 | 3V3 | GND | SDA | GND | SCL | Solar / Cell | GND | + | - | Batt | * | + | Reset | - | Vin | ANALOG IN | RS | 3V3 | GND | 0 1 2 3 4 5
tValues: DNP | DNP | JST-Right Angle | DNP | Production: DNP | Production: DNP | Proto: 2x3 male header up | DNP | DNP | DNP